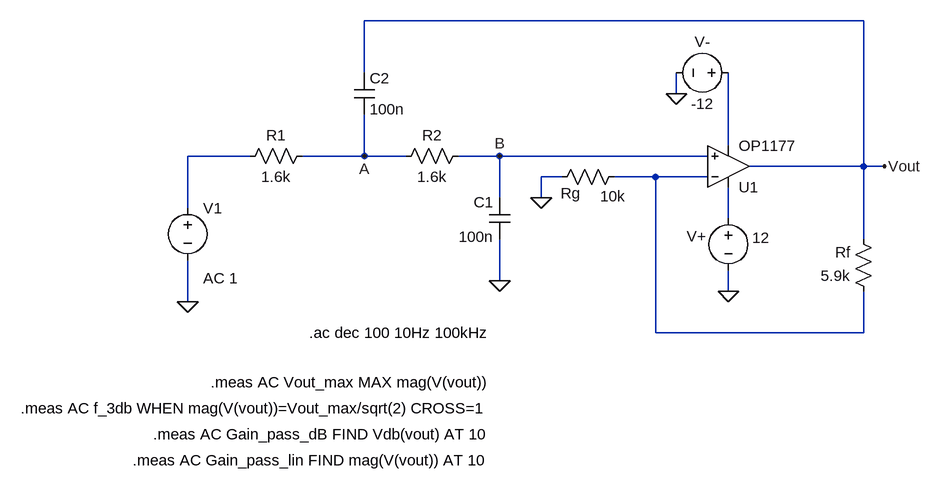
[diagram p0: schematic AFE_SallenKey_R1p6k_baseline_check.asc]
AFE_SallenKey_R1p6k_baseline_check.asc, the LTspice schematic file:
Version 4
SHEET 1 1048 724
WIRE 800 -96 32 -96
WIRE 32 -16 32 -96
WIRE 512 16 512 -16
WIRE 592 96 592 -16
WIRE -144 112 -240 112
WIRE 32 112 32 48
WIRE 32 112 -64 112
WIRE 96 112 32 112
WIRE 240 112 176 112
WIRE 560 112 240 112
WIRE 800 128 800 -96
WIRE 800 128 624 128
WIRE 832 128 800 128
WIRE 336 144 304 144
WIRE 480 144 416 144
WIRE 560 144 480 144
WIRE 240 176 240 112
WIRE 304 176 304 144
WIRE -240 192 -240 112
WIRE 592 208 592 160
WIRE 800 240 800 128
WIRE 240 304 240 240
WIRE 592 320 592 288
WIRE -240 336 -240 272
WIRE 480 384 480 144
WIRE 800 384 800 320
WIRE 800 384 480 384
FLAG 32 112 A
FLAG 240 112 B
FLAG -240 336 0
FLAG 512 16 0
FLAG 240 304 0
FLAG 832 128 Vout
FLAG 592 320 0
FLAG 304 176 0
SYMBOL voltage -240 176 R0
WINDOW 123 24 124 Left 2
WINDOW 39 0 0 Left 0
SYMATTR InstName V1
SYMATTR Value ""
SYMATTR Value2 AC 1
SYMBOL res -48 96 R90
WINDOW 0 0 56 VBottom 2
WINDOW 3 32 56 VTop 2
SYMATTR InstName R1
SYMATTR Value 1.6k
SYMBOL res 192 96 R90
WINDOW 0 0 56 VBottom 2
WINDOW 3 32 56 VTop 2
SYMATTR InstName R2
SYMATTR Value 1.6k
SYMBOL cap 16 -16 R0
SYMATTR InstName C2
SYMATTR Value 100n
SYMBOL cap 224 176 R0
WINDOW 0 -24 7 Left 2
WINDOW 3 -47 60 Left 2
SYMATTR InstName C1
SYMATTR Value 100n
SYMBOL OpAmps\\OP1177 592 192 M180
SYMATTR InstName U1
SYMBOL res 816 336 R180
WINDOW 0 36 76 Left 2
WINDOW 3 36 40 Left 2
SYMATTR InstName Rf
SYMATTR Value 5.9k
SYMBOL res 432 128 R90
WINDOW 0 57 83 VBottom 2
WINDOW 3 30 18 VTop 2
SYMATTR InstName Rg
SYMATTR Value 10k
SYMBOL voltage 592 192 R0
WINDOW 0 -49 59 Bottom 2
WINDOW 3 50 30 Top 2
WINDOW 123 0 0 Left 0
WINDOW 39 0 0 Left 0
SYMATTR InstName V+
SYMATTR Value 12
SYMBOL voltage 608 -16 R90
WINDOW 0 -32 56 VBottom 2
WINDOW 3 32 56 VTop 2
SYMATTR InstName V-
SYMATTR Value -12
TEXT 224 384 Right 2 !.ac dec 100 10Hz 100kHz
TEXT 224 460 Right 2 !.meas AC Vout_max MAX mag(V(vout))
TEXT 224 500 Right 2 !.meas AC f_3db WHEN mag(V(vout))=Vout_max/sqrt(2) CROSS=1
TEXT 224 540 Right 2 !.meas AC Gain_pass_dB FIND Vdb(vout) AT 10
TEXT 224 580 Right 2 !.meas AC Gain_pass_lin FIND mag(V(vout)) AT 10

The netlist it stands for:
* AFE_SallenKey_R1p6k_baseline_check.asc
V1 N002 0 AC 1
R1 A N002 1.6k
R2 B A 1.6k
C2 Vout A 100n
C1 B 0 100n
XU1 B N003 N004 N001 Vout OP1177  ; pins In+ In- V+ V- OUT
Rf N003 Vout 5.9k
Rg N003 0 10k
V+ N004 0 12
V- N001 0 -12
.ac dec 100 10Hz 100kHz
.meas AC Vout_max MAX mag(V(vout))
.meas AC f_3db WHEN mag(V(vout))=Vout_max/sqrt(2) CROSS=1
.meas AC Gain_pass_dB FIND Vdb(vout) AT 10
.meas AC Gain_pass_lin FIND mag(V(vout)) AT 10
.lib ADI1.lib
.backanno
.end